# EAGLE design sc (EAGLE 6.5.0)
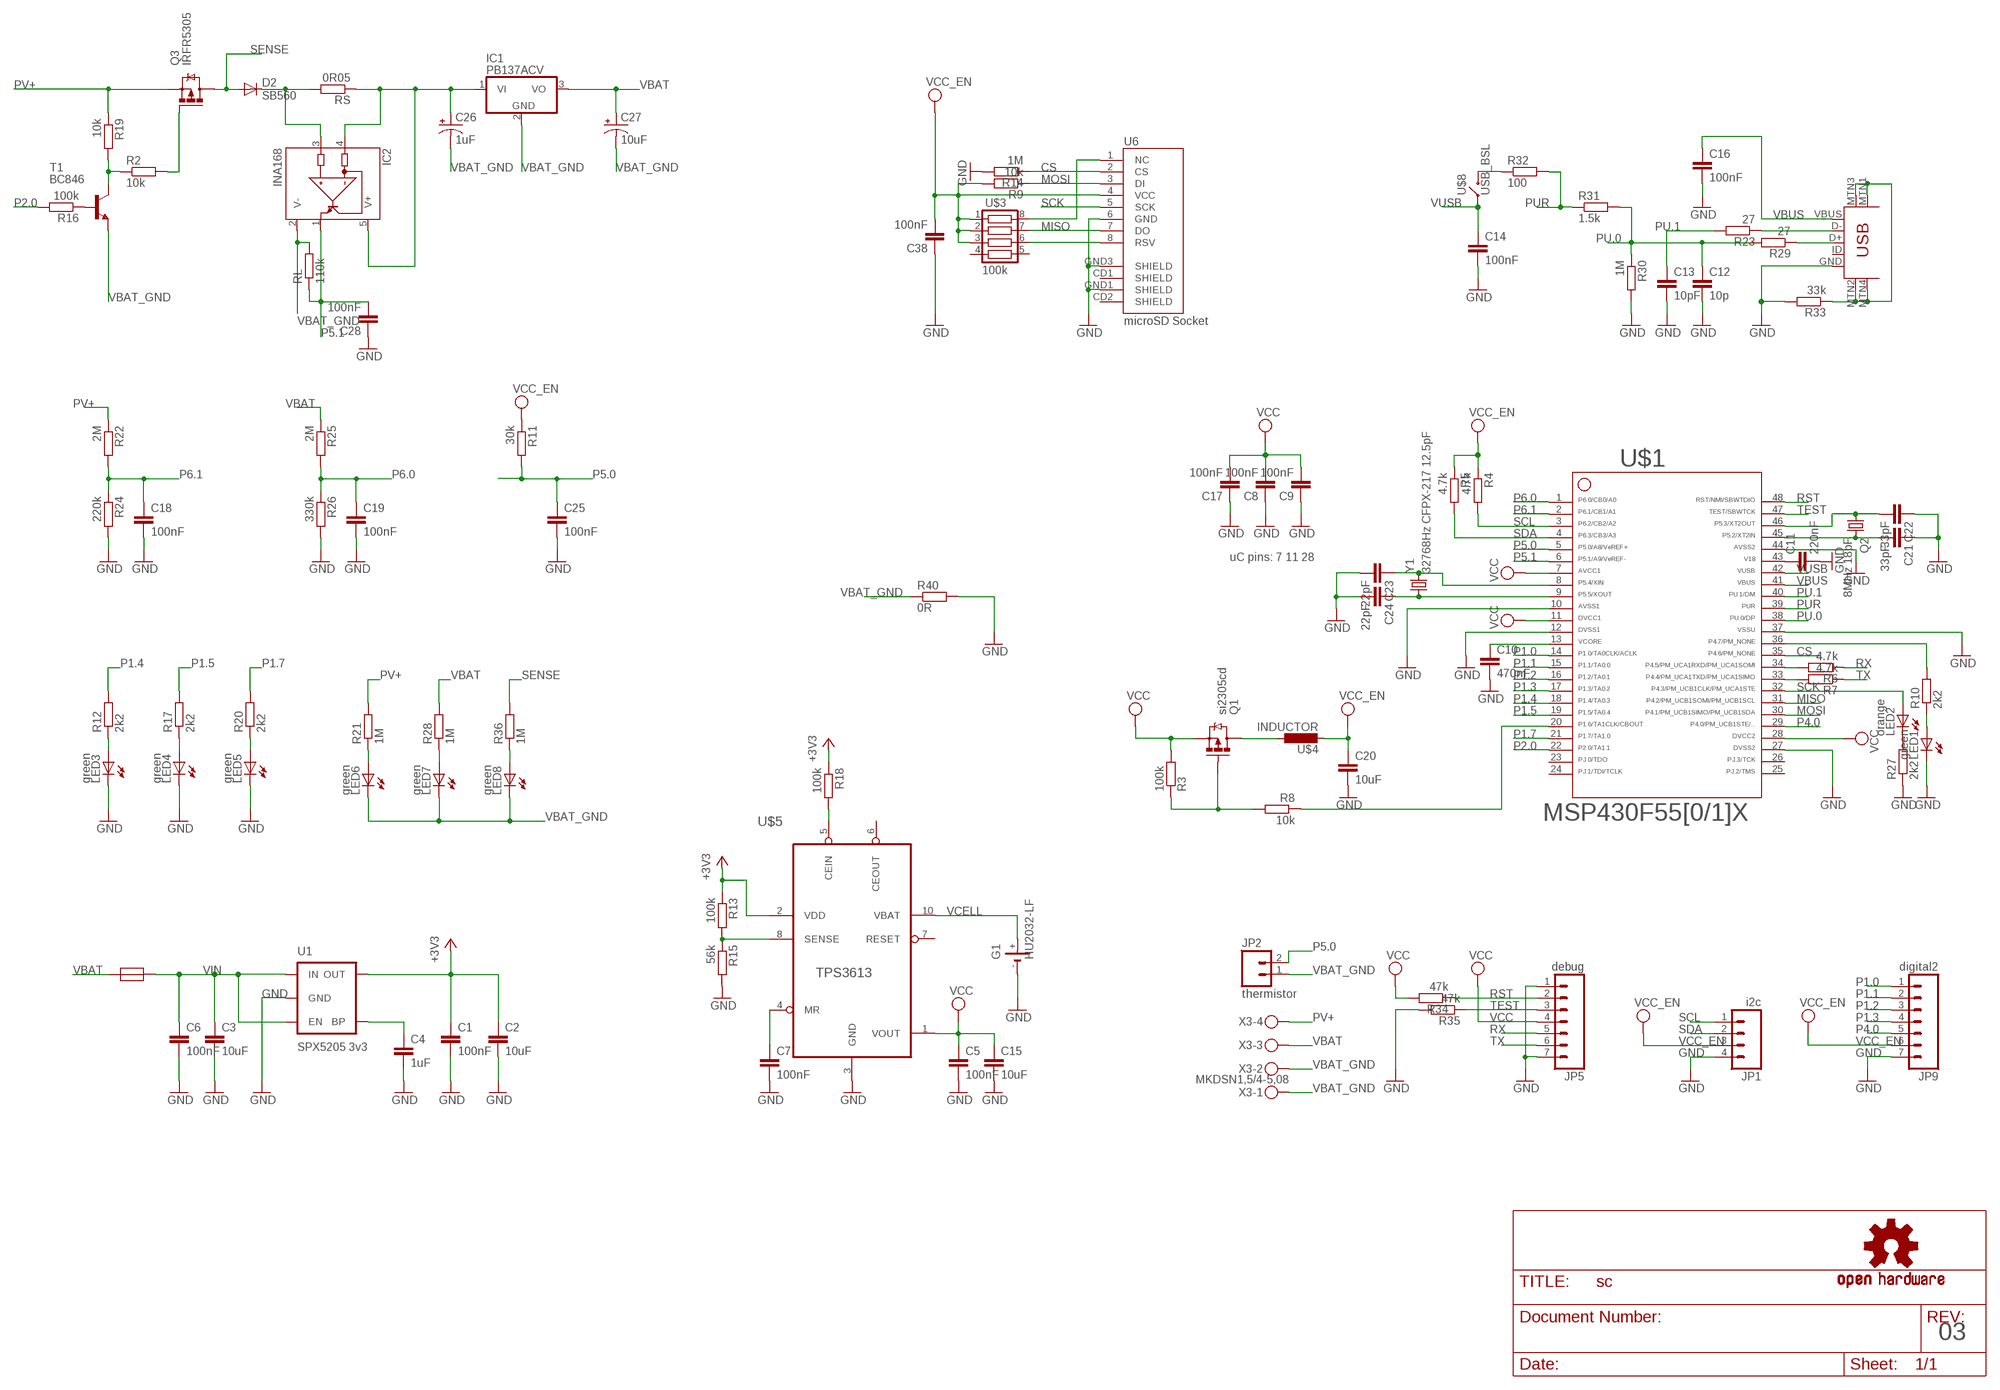
[diagram p0: schematic, sheet 1]

## Parts
C1  100nF  C-EUC0805  [C0805]
C2  10uF  C-EUC1206  [C1206]
C3  10uF  C-EUC1206  [C1206]
C4  1uF  C-EUC0805  [C0805]
C5  100nF  C-EUC0805  [C0805]
C6  100nF  C-EUC0805  [C0805]
C7  100nF  C-EUC0805  [C0805]
C8  100nF  C-EUC0805  [C0805]
C9  100nF  C-EUC0805  [C0805]
C10  470nF  C-EUC0805  [C0805]
C11  220nF  C-EUC0805  [C0805]
C12  10p  C-EUC0805  [C0805]
C13  10pF  C-EUC0805  [C0805]
C14  100nF  C-EUC0805  [C0805]
C15  10uF  C-EUC1206  [C1206]
C16  100nF  C-EUC0805  [C0805]
C17  100nF  C-EUC0805  [C0805]
C18  100nF  C-EUC0805  [C0805]
C19  100nF  C-EUC0805  [C0805]
C20  10uF  C-EUC1206  [C1206]
C21  33pF  C-EUC0805  [C0805]
C22  33pF  C-EUC0805  [C0805]
C23  22pF  C-EUC0805  [C0805]
C24  22pF  C-EUC0805  [C0805]
C25  100nF  C-EUC0805  [C0805]
C26  1uF  CAP_POLD  [PANASONIC_D]
C27  10uF  CAP_POLD  [PANASONIC_D]
C28  100nF  C-EUC0805  [C0805]
C38  100nF  C-EUC0805  [C0805]
D2  SB560  DIODE-C1702-05  [C1702-05]
G1  HU2032-LF  [HU2032-LF]
IC1  PB137ACV  7812TV  [TO220V]
IC2  INA168  [SOT23-5]
JP1  i2c  M04PTH  [1X04]
JP2  thermistor  M02PTH  [1X02]
JP5  debug  M07  [1X07]
JP9  digital2  M07  [1X07]
LED1  green  LEDCHIP-LED0805  [CHIP-LED0805]
LED2  orange  LEDCHIP-LED0805  [CHIP-LED0805]
LED3  green  LEDCHIP-LED0805  [CHIP-LED0805]
LED4  green  LEDCHIP-LED0805  [CHIP-LED0805]
LED5  green  LEDCHIP-LED0805  [CHIP-LED0805]
LED6  green  LEDCHIP-LED0805  [CHIP-LED0805]
LED7  green  LEDCHIP-LED0805  [CHIP-LED0805]
LED8  green  LEDCHIP-LED0805  [CHIP-LED0805]
Q1  si2305cd  MOSFET-PCHANNELSMD_POWER  [SOT23-3_POWER]
Q2  8MHz 18pF  CRYTAL  [CRYSTAL_5X3.2]
Q3  IRFR5305  [D-PAK_TO252AA]
R2  10k  R-EU_R0805W  [R0805W]
R3  100k  R-EU_R0805W  [R0805W]
R4  4.7k  R-EU_R0805W  [R0805W]
R5  4.7k  R-EU_R0805W  [R0805W]
R6  4.7k  R-EU_R0805W  [R0805W]
R7  4.7k  R-EU_R0805W  [R0805W]
R8  10k  R-EU_R0805W  [R0805W]
R9  10k  R-EU_R0805W  [R0805W]
R10  2k2  R-EU_R0805W  [R0805W]
R11  30k  R-EU_R0805W  [R0805W]
R12  2k2  R-EU_R0805W  [R0805W]
R13  100k  R-EU_R0805W  [R0805W]
R14  1M  R-EU_R0805W  [R0805W]
R15  56k  R-EU_R0805W  [R0805W]
R16  100k  R-EU_R0805W  [R0805W]
R17  2k2  R-EU_R0805W  [R0805W]
R18  100k  R-EU_R0805W  [R0805W]
R19  10k  R-EU_R0805W  [R0805W]
R20  2k2  R-EU_R0805W  [R0805W]
R21  1M  R-EU_R0805W  [R0805W]
R22  2M  R-EU_R0805W  [R0805W]
R23  27  R-EU_R0805W  [R0805W]
R24  220k  R-EU_R0805W  [R0805W]
R25  2M  R-EU_R0805W  [R0805W]
R26  330k  R-EU_R0805W  [R0805W]
R27  2k2  R-EU_R0805W  [R0805W]
R28  1M  R-EU_R0805W  [R0805W]
R29  27  R-EU_R0805W  [R0805W]
R30  1M  R-EU_R0805W  [R0805W]
R31  1.5k  R-EU_R0805W  [R0805W]
R32  100  R-EU_R0805W  [R0805W]
R33  33k  R-EU_R0805W  [R0805W]
R34  47k  R-EU_R0805W  [R0805W]
R35  47k  R-EU_R0805W  [R0805W]
R36  1M  R-EU_R0805W  [R0805W]
R40  0R  R-EU_R0805W  [R0805W]
RL  110k  R-EU_R0805W  [R0805W]
RS  0R05  R-EU_TO220_V  [TO220ACS]
T1  BC846  [SOT23]
U1  SPX5205 3v3  V_REG_LDOSMD  [SOT23-5]
U6  microSD Socket  USD-SOCKETNEW  [MICRO-SD-SOCKET-PP]
U$1  F55[0/1]X---PT48  [PT48]
U$2  RESETTABLE  [1210]
U$3  100k  RES_ARR  [YC164]
U$4  INDUCTOR  [L0805W]
U$5  TPS3613  [MSOP_10P]
U$6  USB-MINIB-5PIN  [USB-MINIB]
U$7  OSHW-LOGOM  [OSHW-LOGO-M]
U$8  USB_BSL  TACT_SW  [6X3.5_TACTILE_SW]
X3  MKDSN1,5/4-5,08  [MKDSN1,5/4-5,08]
Y1  32768Hz CFPX-217 12.5pF  CRYSTAL3.2X1.5  [CRYSTAL-SMD-3.2X1.5]

## Nets
+3V3: C1.1 C2.1 R13.1 R18.1 U1.5(OUT) U$5.2(VDD)
CS: R14.1 U6.2(CS) U$1.35
EN: R8.1 U$1.20
GND: C1.2 C2.2 C3.2 C4.2 C5.2 C6.2 C7.2 C8.1 C9.1 C10.2 C11.2 C12.2 C13.2 C14.2 C15.2 C16.2 C17.1 C18.2 C19.2 C20.2 C21.1 C22.1 C23.2 C24.2 C25.2 C28.1 C38.1 G1.- JP1.4 JP5.1 JP5.7 JP9.7 LED1.C LED3.C LED4.C LED5.C R14.2 R15.2 R24.2 R26.2 R27.1 R30.2 R33.2 R35.2 R40.2 U1.2(GND) U6.6(GND) U6.GND1(SHIELD) U6.GND3(SHIELD) U$1.10 U$1.12 U$1.27 U$1.37 U$1.44 U$5.3(GND) U$6.GND
LED: R10.2 U$1.36
MISO: U6.7(DO) U$1.31 U$3.7
MOSI: R9.1 U6.3(DI) U$1.30
N$1: LED1.A R10.1
N$2: C4.1 U1.4(BP)
N$3: R16.1 T1.1(B)
N$4: U6.1(NC) U$3.8
N$5: R2.1 R19.2 T1.3(C)
N$6: C10.1 U$1.13
N$7: C11.1 U$1.43
N$9: LED3.A R12.1
N$10: C26.+ IC1.1(VI) IC2.4(IN-) IC2.5(V+) RS.A
N$11: R6.2 U$1.34
N$12: LED6.A R21.1
N$13: R7.2 U$1.33
N$14: Q1.1(G) R3.1 R8.2
N$15: LED4.A R17.1
N$16: LED5.A R20.1
N$17: C22.2 Q2.P$1 U$1.46
N$18: LED7.A R28.1
N$19: R13.2 R15.1 U$5.8(SENSE)
N$20: C7.1 U$5.4(MR)
N$21: R18.2 U$5.5(CEIN)
N$22: R29.1 U$6.D+
N$23: C21.2 Q2.P$2 U$1.45
N$24: LED8.A R36.1
N$25: C24.1 U$1.9 Y1.P$1
N$26: C23.1 U$1.8 Y1.P$2
N$27: U6.8(RSV) U$3.6
N$28: Q3.1(G) R2.2
N$29: R23.1 U$6.D-
N$30: D2.C IC2.3(IN+) RS.C
N$34: R32.1 U$8.2
N$36: R33.1 U$6.MTN1(MTN2) U$6.MTN2(MTN3) U$6.MTN3(MTN1) U$6.MTN4
N$37: Q1.3(D) U$4.1
N$39: LED2.C R27.2
P1.0: JP9.1 U$1.14
P1.1: JP9.2 U$1.15
P1.2: JP9.3 U$1.16
P1.3: JP9.4 U$1.17
P1.4: R12.2 U$1.18
P1.5: R17.2 U$1.19
P1.7: R20.2 U$1.21
P2.0: R16.2 U$1.22
P4.0: JP9.5 U$1.29
P5.0: C25.1 JP2.2 R11.2 U$1.5
P5.1: C28.2 IC2.1(OUT) RL.1 U$1.6
P6.0: C19.1 R25.2 R26.1 U$1.1
P6.1: C18.1 R22.2 R24.1 U$1.2
PU.0: C12.1 R29.2 R30.1 R31.2 U$1.38
PU.1: C13.1 R23.2 U$1.40
PUR: R31.1 R32.2 U$1.39
PV+: Q3.3(S) R19.1 R21.2 R22.1 X3.4
RST: JP5.2 R34.1 U$1.48
RX: JP5.5 R6.1
SCK: LED2.A U6.5(SCK) U$1.32
SCL: JP1.1 R4.2 U$1.3
SDA: JP1.2 R5.2 U$1.4
SENSE: D2.A Q3.4(D) R36.2
TEST: JP5.3 R35.1 U$1.47
TX: JP5.6 R7.1
VBAT: C27.+ IC1.3(VO) R25.1 R28.2 U$2.P$1 X3.3
VBAT_GND: C26.- C27.- IC1.2(GND) IC2.2(V-) JP2.1 LED6.C LED7.C LED8.C R40.1 RL.2 T1.2(E) X3.1 X3.2
VBUS: C16.1 U$1.41 U$6.VBUS
VCC: C5.1 C8.2 C9.2 C15.1 C17.2 JP5.4 Q1.2(S) R3.2 R34.2 U$1.7 U$1.11 U$1.28 U$5.1(VOUT)
VCC_EN: C20.1 C38.2 JP1.3 JP9.6 R4.1 R5.1 R9.2 R11.1 U6.4(VCC) U$3.1 U$3.2 U$3.3 U$4.2
VCELL: G1.+ U$5.10(VBAT)
VIN: C3.1 C6.1 U1.1(IN) U1.3(EN) U$2.P$2
VUSB: C14.1 U$1.42 U$8.1
Unconnected: G1.+@1(+) U6.CD1(SHIELD) U6.CD2(SHIELD) U$1.23 U$1.24 U$1.25 U$1.26 U$3.4 U$3.5 U$5.6(CEOUT) U$5.7(RESET) U$6.ID

## Notes on the sheet
- uC pins: 7 11 28
- 03

## Library data of the parts
C1-C25 C28 C38 = rcl:C-EU: CAPACITOR, European symbol
C26 C27 = SparkFun-Capacitors:CAP_POL: Capacitor Polarized These are standard SMD and PTH capacitors. Normally 10uF, 47uF, and 100uF in electrolytic and tantalum varieties. Always verify the external diameter of the through hole cap, it varies with capacity, voltage, and manufacturer. The EIA devices should be standard.
D2 = diode:DIODE-: DIODE
G1 = Simplex-Battery:HU2032-LF: Renata HU2032 Li battery holder
IC1 = linear:78*: Positive VOLTAGE REGULATOR Source: http://cache.national.com/ds/LM/LM78L05.pdf http://www.fairchildsemi.com/ds/LM/LM7805.pdf
IC2 = burr-brown:INA168: High-Side Measurement Current Shunt Monitor; MF: TEXAS INSTRUMENTS; MPN: INA168NA/250; OC_FARNELL: 4375737; OC_NEWARK: 35C1744
JP1 = SparkFun-Connectors:M04: Header 4 Standard 4-pin 0.1" header. Use with straight break away headers (SKU : PRT-00116), right angle break away headers (PRT-00553), swiss pins (PRT-00743), machine pins (PRT-00117), and female headers (PRT-00115). Molex polarized connector foot print use with SKU : PRT-08231 with associated crimp pins and housings. 1MM SMD Version SKU: PRT-10208
JP2 = SparkFun-Connectors:M02: Header 2 Standard 2-pin 0.1" header. Use with straight break away headers (SKU : PRT-00116), right angle break away headers (PRT-00553), swiss pins (PRT-00743), machine pins (PRT-00117), and female headers (PRT-00115). Molex polarized connector foot print use with SKU : PRT-08233 with associated crimp pins and housings.
JP5 JP9 = SparkFun-Connectors:M07: Header 7 Standard 7-pin 0.1" header. Use with straight break away headers (SKU : PRT-00116), right angle break away headers (PRT-00553), swiss pins (PRT-00743), machine pins (PRT-00117), and female headers (PRT-00115). NOTES ON THE VARIANTS LOCK and LOCK_LONGPADS... This footprint was designed to help hold the alignment of a through-hole component (i.e. 7-pin header) while soldering it into place. You may notice that each hole has been shifted either up or down by 0.005 of an inch from it's more standard position (which is usually a perfectly straight line). This slight alteration caused the pins (the squares in the middle) to touch the edges of the holes. Because they are alternating, it causes a "brace" to hold the header in place. 0.005 has proven to be the perfect amount of "off-center" position when using our standard breakaway headers. Although looks a little odd when you look at the bare footprint, once you have a header in there, the alteration is very hard to notice. Also, if you push a header all the way into place, it is covered up entirely on the bottom side. This idea of altering the position of holes to aid alignment will be further integrated into the Sparkfun Library for other footprints. It can help hold any component with 3 or more connection pins.
LED1-LED8 = led:LED: LED OSRAM: - CHIPLED LG R971, LG N971, LY N971, LG Q971, LY Q971, LO R971, LY R971 LH N974, LH R974 LS Q976, LO Q976, LY Q976 LO Q996 - Hyper CHIPLED LW Q18S LB Q993, LB Q99A, LB R99A - SideLED LS A670, LO A670, LY A670, LG A670, LP A670 LB A673, LV A673, LT A673, LW A673 LH A674 LY A675 LS A676, LA A676, LO A676, LY A676, LW A676 LS A679, LY A679, LG A679 - Hyper Micro SIDELED® LS Y876, LA Y876, LO Y876, LY Y876 LT Y87S - SmartLED LW L88C, LW L88S LB L89C, LB L89S, LG L890 LS L89K, LO L89K, LY L89K LS L896, LA L896, LO L896, LY L896 - TOPLED LS T670, LO T670, LY T670, LG T670, LP T670 LSG T670, LSP T670, LSY T670, LOP T670, LYG T670 LG T671, LOG T671, LSG T671 LB T673, LV T673, LT T673, LW T673 LH T674 LS T676, LA T676, LO T676, LY T676, LB T676, LH T676, LSB T676, LW T676 LB T67C, LV T67C, LT T67C, LS T67K, LO T67K, LY T67K, LW E67C LS E67B, LA E67B, LO E67B, LY E67B, LB E67C, LV E67C, LT E67C LW T67C LS T679, LY T679, LG T679 LS T770, LO T770, LY T770, LG T770, LP T770 LB T773, LV T773, LT T773, LW T773 LH T774 LS E675, LA E675, LY E675, LS T675 LS T776, LA T776, LO T776, LY T776, LB T776 LHGB T686 LT T68C, LB T68C - Hyper Mini TOPLED® LB M676 - Mini TOPLED Santana® LG M470 LS M47K, LO M47K, LY M47K Source: http://www.osram.convergy.de LUXEON: - LUMILED® LXK2-PW12-R00, LXK2-PW12-S00, LXK2-PW14-U00, LXK2-PW14-V00 LXK2-PM12-R00, LXK2-PM12-S00, LXK2-PM14-U00 LXK2-PE12-Q00, LXK2-PE12-R00, LXK2-PE12-S00, LXK2-PE14-T00, LXK2-PE14-U00 LXK2-PB12-K00, LXK2-PB12-L00, LXK2-PB12-M00, LXK2-PB14-N00, LXK2-PB14-P00, LXK2-PB14-Q00 LXK2-PR12-L00, LXK2-PR12-M00, LXK2-PR14-Q00, LXK2-PR14-R00 LXK2-PD12-Q00, LXK2-PD12-R00, LXK2-PD12-S00 LXK2-PH12-R00, LXK2-PH12-S00 LXK2-PL12-P00, LXK2-PL12-Q00, LXK2-PL12-R00 Source: www.luxeon.com KINGBRIGHT: KA-3528ASYC Source: www.kingbright.com
Q1 = Simplex-DiscreteSemi:MOSFET-PCHANNEL: Generic PMOSFET
Q2 = Omat_komponentit:CRYTAL: CRYSTAL
Q3 = transistor-power:IRF?5305: HEXFET Power MOSFET Source: http://www.irf.com/product-info/datasheets/data/irfr5305pbf.pdf
R2-R36 R40 RL = rcl:R-EU_: RESISTOR, European symbol
RS = Simplex-rlc:R-EU_: RESISTOR, European symbol
T1 = transistor:BC846: NPN TRANSISTOR
U1 = SparkFun:V_REG_LDO: Voltage Regulator LDO Standard 150mA LDO voltage regulator in SOT-23 layout. Micrel part MIC5205. BP (by-pass) pin is used to lower output noise with 470pF cap.
U6 = SparkFun:USD-SOCKET: microSD Socket Push-push type uSD socket. Schematic element and footprint production proven. Spark Fun Electronics SKU : PRT-00127. tDoc lines correctly indicate media card edge positions when inserting (unlocked, locked, depressed).
U$1 = TI_MSP430_v16:F55[0/1]X---PT48: ***F55[0/1/2]X*** PT48 Rev. 1.0 06/2010 "http://www.ti.com/lit/gpn/msp430f5509" Only for FF5504, F5508,F5509,F5510
U$2 = Simplex-Fuses:RESETTABLE
U$3 = Simplex-rlc:RES_ARR: resistor chip array yageo YC164 series (8pin/4R)
U$4 = Simplex-rlc:INDUCTOR: smd inductors
U$5 = Simplex-ICs:TPS3613: Texas Instruments TPS3613 Adjustable battery-backup supervisor for RAM retension
U$6 = SparkFun-Connectors:USB-MINIB: Mini-USB "B" connector with 5th pin broken out. Created new symbol breaking out 5th "ID" pin in mini/micro USB connector spec. See: http://en.wikipedia.org/wiki/Mini_usb#Cables. Uses same footprint as 4-pin symbol. Also added pins to connect to mounting / shield pads if required (probably not generally needed as signals aren't shielded once they leave the connector).
U$7 = SparkFun:OSHW-LOGO: Open Source Hardware Logo This logo indicates the piece of hardware it is found on incorporates a OSHW license and/or adheres to the definition of open source hardware found here: http://freedomdefined.org/OSHW
U$8 = Simplex-Switches:TACT_SW: SPST tactile switches
X3 = con-phoenix-508:MKDSN1,5/4-5,08: MKDSN 1,5/ 4-5,08 Printklemme Nennstrom: 13,5 A Nennspannung: 250 V Rastermaß: 5,08 mm Polzahl: 4 Anschlussart: Schraubanschluss Montage: Löten Anschlussrichtung Leiter/Platine: 0 ° Artikelnummer: 1729144 Source: http://eshop.phoenixcontact.com .. 1729144.pdf; MPN: SMKDSN1,5/4-5,08; OC_FARNELL: 1792905; OC_NEWARK: 70R0300
Y1 = Simplex-FreqCtrl:CRYSTAL: smd crystals

## Net classes
1 vcc: width 0.203 mm

## Board
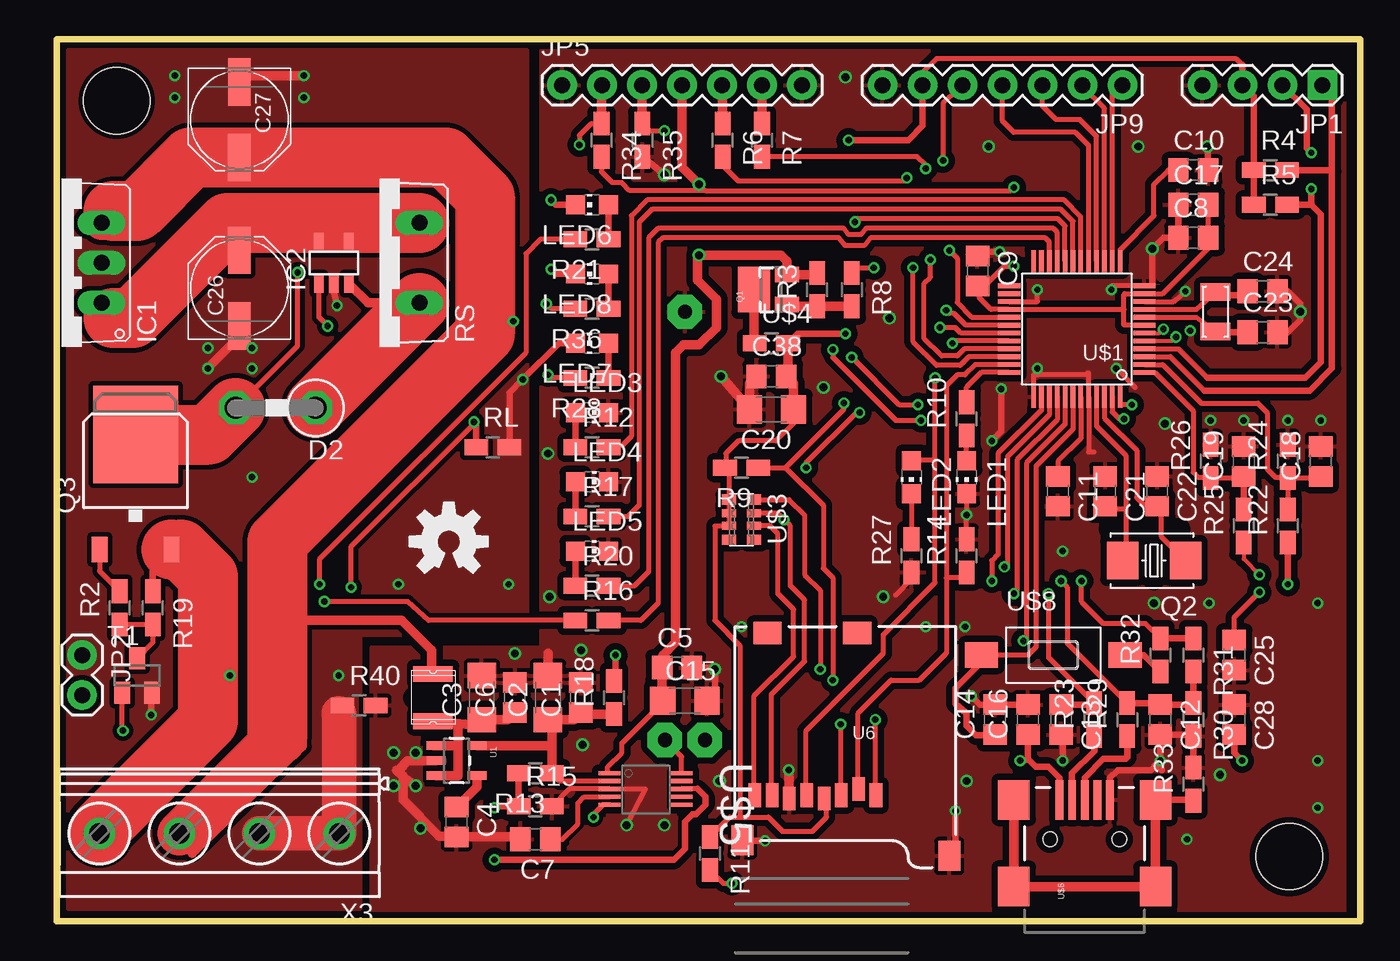
[diagram p1: board, top side]
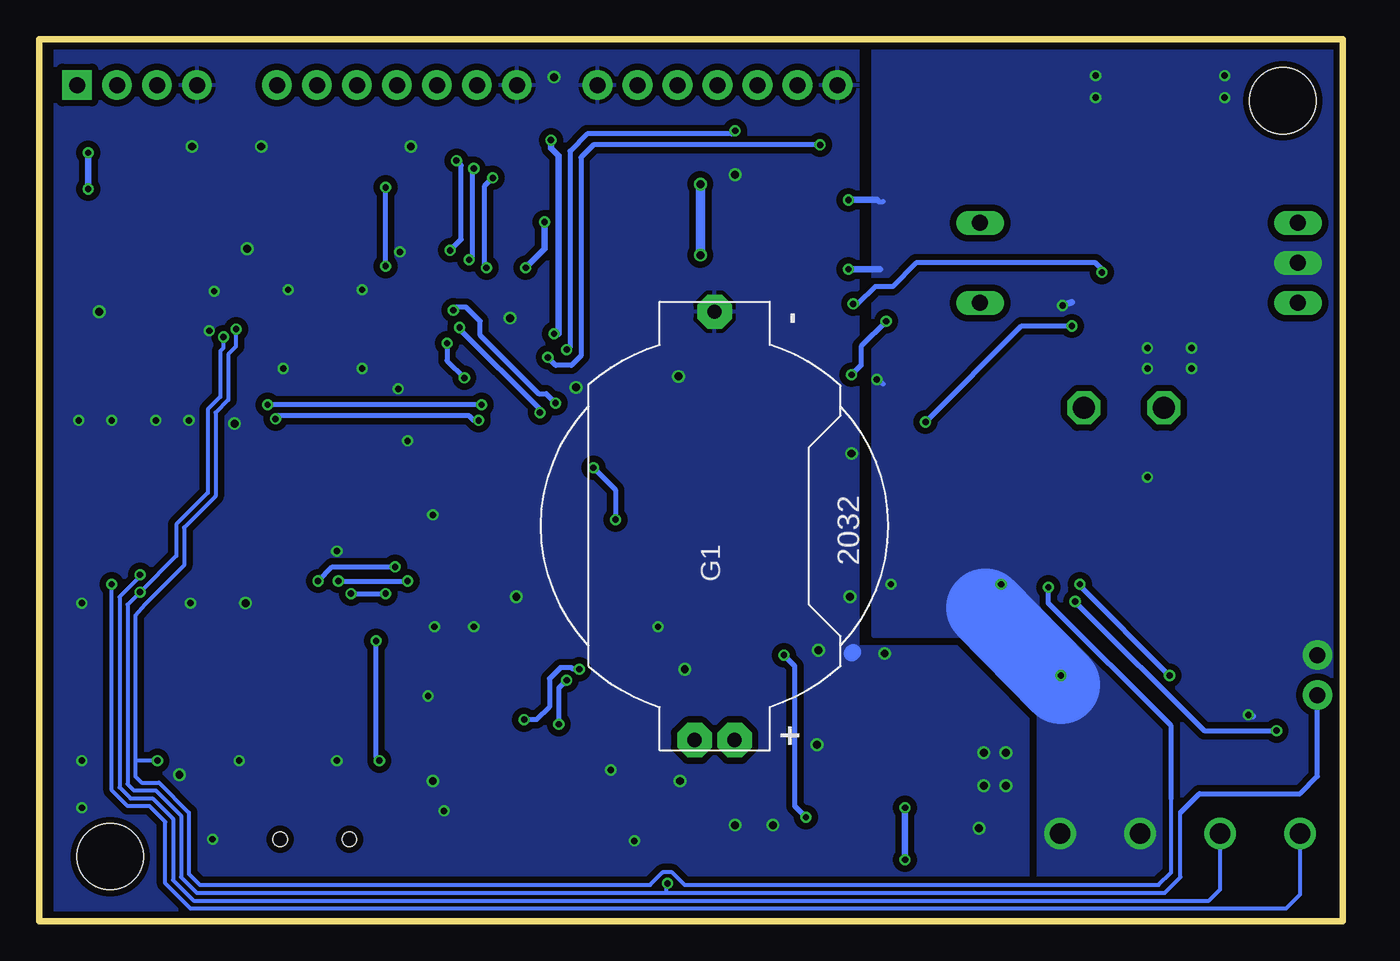
[diagram p2: board, bottom side, seen from below]

Size 82.8 x 56 mm. Coordinates in mm from the lower left corner, seen from the top.
Outline: 0,0 82.8,0 82.8,56 0,56 0,0
Copper layers (1*16): Top 0.035mm / dielectric 1.5mm / Bottom 0.035mm
Design rules "seeedstudio_rules_v1.1": minimum track width 6mil, minimum drill 12mil, track to track 6mil, track to pad 6mil, pad to pad 6mil, via to via 6mil, smd to smd 0mil, copper to edge 10mil, drill to drill 10mil, minimum pad ring 10mil, minimum via ring 6mil, stop-mask expansion 2mil, vias tented up to drill 100mil, thermal gap 10mil
Holes 4.2 mm at 3.8,52.1 78.3,4.1
tRestrict: 4 lines

### Footprints (pad centres in the part's own frame; a part is rotated, then mirrored left to right if it is on the bottom)
C0805 = smd 1.3 x 1.5: 1 -0.95,0; 2 0.95,0
C1206 = smd 1.6 x 1.8: 1 -1.4,0; 2 1.4,0
PANASONIC_D = smd 3 x 1.4: + 2.4,0; - -2.4,0
C1702-05 = drill 1.397 octagon: A 2.54,0; C -2.54,0
HU2032-LF = drill 0.9 pad 2.184 octagon: + -13.6,-1.27; +@1 -13.6,1.27; - 13.6,0
TO220V = drill 1.016 long: 1 -2.54,-2.54; 2 0,-2.54; 3 2.54,-2.54
SOT23-5 = smd 0.6 x 1.2: 1 -0.95,-1.306; 2 0,-1.306; 3 0.95,-1.306; 4 0.95,1.306; 5 -0.95,1.306
1X04 = drill 1.016 pad 1.88 square: 1 0,0 | drill 1.016 pad 1.88: 2 2.54,0; 3 5.08,0; 4 7.62,0
1X02 = drill 1.016 pad 1.88: 1 0,0; 2 2.54,0
1X07 = drill 1.016 pad 1.88: 1 0,0; 2 2.54,0; 3 5.08,0; 4 7.62,0; 5 10.16,0; 6 12.7,0; 7 15.24,0
CHIP-LED0805 = smd 1.2 x 1.2: A 0,-1.05; C 0,1.05
SOT23-3_POWER = smd 1 x 1.5: 1 -0.939,-1.384; 2 0.961,-1.384 | smd 2.9 x 2.05: 3 0.011,0.716
CRYSTAL_5X3.2 = smd 2 x 2.4: P$1 -2,0; P$2 2,0
D-PAK_TO252AA = smd 1 x 1.6: 1 -2.28,-4.8; 3 2.28,-4.8 | smd 5.4 x 6.2: 4 0,2.5
R0805W = smd 1.5 x 1: 1 -1.052,0; 2 1.052,0
TO220ACS = drill 1.016 long: A 2.54,-2.54; C -2.54,-2.54
SOT23 = smd 1 x 1.4: 1 -0.95,-1.1; 2 0.95,-1.1; 3 0,1.1
SOT23-5' = smd 0.55 x 1.2: 1 -0.95,-1.3; 2 0,-1.3; 3 0.95,-1.3; 4 0.95,1.3; 5 -0.95,1.3
MICRO-SD-SOCKET-PP = smd 0.8 x 1.5: 1 -8.94,10.7; 2 -7.84,10.3; 3 -6.74,10.7; 4 -5.64,10.9; 5 -4.54,10.7; 6 -3.44,10.9; 7 -2.34,10.7; 8 -1.24,10.7 | smd 1.8 x 1.4: CD1 -2.05,0.4; CD2 -7.75,0.4 | smd 1.4 x 1.9: GND1 -13.6,14.55; GND3 -0.45,13.55
PT48 = smd 1.4 x 0.3: 1 -4.3,2.75; 2 -4.3,2.25; 3 -4.3,1.75; 4 -4.3,1.25; 5 -4.3,0.75; 6 -4.3,0.25; 7 -4.3,-0.25; 8 -4.3,-0.75; 9 -4.3,-1.25; 10 -4.3,-1.75; 11 -4.3,-2.25; 12 -4.3,-2.75; 25 4.3,-2.75; 26 4.3,-2.25; 27 4.3,-1.75; 28 4.3,-1.25; 29 4.3,-0.75; 30 4.3,-0.25; 31 4.3,0.25; 32 4.3,0.75; 33 4.3,1.25; 34 4.3,1.75; 35 4.3,2.25; 36 4.3,2.75 | smd 0.3 x 1.4: 13 -2.75,-4.3; 14 -2.25,-4.3; 15 -1.75,-4.3; 16 -1.25,-4.3; 17 -0.75,-4.3; 18 -0.25,-4.3; 19 0.25,-4.3; 20 0.75,-4.3; 21 1.25,-4.3; 22 1.75,-4.3; 23 2.25,-4.3; 24 2.75,-4.3; 37 2.75,4.3; 38 2.25,4.3; 39 1.75,4.3; 40 1.25,4.3; 41 0.75,4.3; 42 0.25,4.3; 43 -0.25,4.3; 44 -0.75,4.3; 45 -1.25,4.3; 46 -1.75,4.3; 47 -2.25,4.3; 48 -2.75,4.3
1210 = smd 1 x 2.5: P$1 -1.5,0; P$2 1.5,0
YC164 = smd 0.65 x 0.9: 1 -1.275,-0.8; 4 1.275,-0.8; 5 1.275,0.8; 8 -1.275,0.8 | smd 0.5 x 0.9: 2 -0.4,-0.8; 3 0.4,-0.8; 6 0.4,0.8; 7 -0.4,0.8
L0805W = smd 1.5 x 1: 1 -1.052,0; 2 1.052,0
MSOP_10P = smd 0.27 x 1.4: 1 0,0; 2 0.5,0; 3 1,0; 4 1.5,0; 5 2,0; 6 2,4.6; 7 1.5,4.6; 8 1,4.6; 9 0.5,4.6; 10 0,4.6
USB-MINIB = smd 2.5 x 0.5: D+ 2.5,0; D- 2.5,0.8; GND 2.5,-1.6; ID 2.5,-0.8; VBUS 2.5,1.6 | smd 2.5 x 2: MTN1 -3,4.5; MTN2 2.5,4.5; MTN3 -3,-4.5; MTN4 2.5,-4.5 | hole 0.9: 0,2.2; 0,-2.2
6X3.5_TACTILE_SW = smd 2.12 x 1.6: 1 -4.56,0; 2 4.56,0
MKDSN1,5/4-5,08 = drill 1.3 pad 2: 1 -7.641,0.025; 2 -2.561,0.025; 3 2.519,0.025; 4 7.599,0.025
CRYSTAL-SMD-3.2X1.5 = smd 1.1 x 1.9: P$1 -1.25,0; P$2 1.25,0

### Placement (x,y rotation side)
C1  33.3,14.2 90 top
C2  31.2,14.2 90 top
C3  27,14.2 90 top
C4  25.4,6.3 270 top
C5  39.4,16.1 0 top
C6  29.1,14.2 90 top
C7  30.4,5.2 180 top
C8  72.2,43.4 0 top
C9  58.5,41.3 270 top
C10  72.2,47.7 0 top
C11  63.6,27.3 270 top
C12  70.1,12.8 270 top
C13  63.8,12.8 270 top
C14  59.6,12.8 90 top
C15  39.9,14 0 top
C16  61.7,12.8 90 top
C17  72.2,45.5 0 top
C18  80.3,29.2 90 top
C19  75.4,29.2 90 top
C20  45.4,32.5 180 top
C21  66.6,27.3 270 top
C22  69.9,27.3 270 top
C23  76.6,37.4 0 top
C24  76.6,40 0 top
C25  74.8,16.9 270 top
C26  11.6,40.2 90 top
C27  11.6,50.9 270 top
C28  74.8,12.8 270 top
C38  45.4,34.6 0 top
D2  13.9,32.6 180 top
G1  39.9,25.1 90 bottom
IC1  0.3,41.8 90 top
IC2  17.6,41.8 0 top
JP1  80.4,53.1 180 top
JP2  1.6,16.9 270 top
JP5  32.1,53.1 0 top
JP9  67.7,53.1 180 top
LED1  57.8,28.2 180 top
LED2  54.3,28.2 180 top
LED3  34,32.3 270 top
LED4  34,27.9 270 top
LED5  34,23.5 270 top
LED6  34,45.5 90 top
LED7  34,36.7 90 top
LED8  34,41.1 90 top
Q1  45,40.1 90 top
Q2  69.7,22.9 180 top
Q3  5,28.4 0 top
R2  4,19.9 90 top
R3  48.3,40.1 90 top
R4  77.1,47.7 0 top
R5  77.1,45.5 0 top
R6  42.3,49.6 270 top
R7  44.8,49.6 270 top
R8  50.5,40.1 270 top
R9  43.5,28.8 180 top
R10  57.8,31.9 90 top
R11  41.5,4.3 270 top
R12  34,30.1 0 top
R13  30.4,9.4 180 top
R14  57.8,23.2 90 top
R15  30.4,7.3 0 top
R16  34,19.1 0 top
R17  34,25.7 0 top
R18  35.4,14.2 90 top
R19  6.1,19.9 270 top
R20  34,21.3 0 top
R21  34,43.3 180 top
R22  78.2,25.1 90 top
R23  65.9,12.8 90 top
R24  78.2,29.2 90 top
R25  75.4,25.1 90 top
R26  73.3,29.2 90 top
R27  54.3,23.2 90 top
R28  34,34.5 180 top
R29  68,12.8 90 top
R30  72.2,12.8 270 top
R31  72.2,16.9 270 top
R32  70.1,16.9 90 top
R33  72.2,8.7 90 top
R34  34.6,49.6 270 top
R35  37.2,49.6 270 top
R36  34,38.9 180 top
R40  19.2,13.7 0 top
RL  27.7,30.1 0 top
RS  20.5,41.8 90 top
T1  5.1,15.6 0 top
U1  SPX5205 3v3  [SOT23-5']  25.4,10.2 270 top
U6  43.1,18.7 180 top
U$1  64.8,37.6 180 top
U$2  23.9,14.2 270 top
U$3  43.5,25.5 270 top
U$4  45.4,36.7 0 top
U$5  35.1,9.4 270 top
U$6  65.3,5.2 90 top
U$7  24.9,24.1 0 top
U$8  63.3,16.9 0 top
X3  10.3,5.6 180 top
Y1  73.6,38.7 270 top

### Tracks (layer width: path | path; a pad name or v marks a point on that pad's centre or on a via)
+3V3
  Top 0.305: U$5.2 31.95,8.9 R13.1
  Top 0.406: 31.25,9.6 R13.1
  Top 0.61: 31.25,9.6 arc90 R13.1 31.45,11.15 | U1.5 31.45,11.15 | 31.45,11.15 31.45,12.55 C2.1 32.85,12.8 C1.1 33.3,13.15 R18.1
CS
  Top 0.305: U6.2 50.9,8.44 50.9,13.2 53,15.3 54.8,15.3 56.5,17 56.5,21.8 | U$1.35 58.35,35.35 57.7,34.7 57.2,34.7 56.5,34 56.5,21.8 | R14.1 57.45,21.8 56.5,21.8
EN  (via drill 0.4)
  Top 0.305: U$1.20 64.05,44.15 63.6,44.6 50.7,44.6 v50.7,44.4 | R8.1 50.85,41.5 v51.9,41.5
  Bottom 0.406: v50.7,44.4 50.7,42.7 v51.9,41.5
GND  (via drill 0.4, 0.5)
  Top 0.305: v36.2,6.1 37.4,8.4 U$5.3 32.55,8.4 R15.2 | U$1.10 70.95,39.35 v71.7,40 | 65.55,34.7 62.3,34.7 | U$1.37 62.05,34.7 62.3,34.7 | U$1.27 62.3,39.35 v62.3,40.1 | 62.3,34.7 v62.3,35.1 | U$1.12 67,40.35 v67,40.1 | R14.2 v57.8,25.8 LED1.C | 53.3,20.7 54.3,21.7 R27.1 | U$1.44 65.55,29.8 65.9,29.8 | v67.3,35.1 68.5,33.9 | 65.55,33.1 65.55,34.8 65.5,34.8
  Top 0.406: 69.85,9.95 69.5,9.6 67.4,9.6 66.9,9.1 U$6.GND | 69.85,9.95 v70.1,10.2 | v70.1,10.2 C12.2 72.1,11.85 R30.2 R33.2 | v63.9,10.2 63.9,11.75 C13.2 | C16.2 C14.2 58.65,13.75 v58.1,14.3 | v70.1,10.2 70.2,9.6 69.85,9.95 | C15.2 41.8,14.5 v41.8,16 41.7,16.1 C5.2 | 46.4,7.74 U6.6 | C24.2 78.2,40 79,39.2 v79,38.7 79,38.2 78.2,37.4 C23.2 | C17.1 C8.1 70.3,43.4 v69.6,42.7 69.6,40.4 | v73.1,49.2 C10.2 | R35.2 v38.6,47.4 | v60,33.8 60,31.1 v59.4,30.5 | C9.1 58.75,42.5 v59.9,42.5 | U6.GND1 57.1,4.55 v57.1,7 | U6.GND3 43.6,5.1 v45,5.1
  Top 0.61: U1.2 22.3,10.2 21.7,9.6 21.6,9.6 22,9.2 | v22.8,8.6 22.2,9 22,9.2 | C7.2 29.3,5.35 C4.2 25.35,5.4 24.3,5.4 22,7.7 22,9.2 | C20.2 v42.2,34.6 | C20.2 44,32.75 | C38.1 44,34.15 C20.2 | v46.5,9.6 46.5,7.84 U6.6 | C2.2 31.2,17
  Bottom 1.016: 31.1,17.1 31.2,17
  other vias: 33.3,17.2 38.6,6.1 22.8,10.7 31.2,29.7 63.9,23.5 69.7,20.2 29.1,17 52.9,38.3 59.2,49.2 50.1,53.6 70.4,31.6 42.1,8.9 68.7,49.2 52.5,20.6 23.1,5.9 21.4,10.7 21.4,8.6 55.2,18.7 43.5,18.7 80.1,7.2 73.2,20.2 80.1,20.2 80.1,10.2 80.3,31.8 57.8,8.9 73.9,9.3 73.3,31.8 75.4,31.8 78.2,31.8 72,37.5 31.3,20.6 71.8,5.2 57.7,18.7 48.7,33.9 33.4,11.2
  pour Top (isolate 0.254): 36,9.8 38.8,9.8 38.8,6.6 40.4,6.6 40.4,4.6 32.7,4.6 32.7,6.5 36,6.5
  pour Top (isolate 0.254): 20.8,11 23.2,11 23.2,8.3 20.8,8.3
  pour Bottom (isolate 0.406): 30.8,55.4 81.8,55.4 81.8,0.6 30.8,0.6
  pour Bottom (isolate 0.406): 20,17.4 33.2,17.4 33.2,0.5 20,0.5
  pour Top (isolate 0.406): 30.8,55.4 81.8,55.4 81.8,0.6 30.8,0.6
  pour Top (isolate 0.406): 20,17.4 33.2,17.4 33.2,0.5 20,0.5
LED
  Top 0.305: U$1.36 58.75,34.85 57.8,33.9 R10.2
MISO  (via drill 0.4)
  Top 0.305: U6.7 45.4,8.04 45.4,14.4 47.5,16.5 47.5,20.4 46.6,21.3 46.6,25.1 v46.2,25.5 45.8,25.9 U$3.7 | U$1.31 57.45,37.35 57.1,37.7 v56.1,37.7 | v47.6,28.8 47.6,29.1 50.8,32.3 v51,32.3
  Bottom 0.305: v46.2,25.5 46.2,27.4 v47.6,28.8 | v51,32.3 51,32.5 56.1,37.6 v56.1,37.7
MOSI  (via drill 0.4)
  Top 0.305: U6.3 49.8,8.04 v49.8,12.5 | U$1.30 57.75,37.85 57,38.6 56.7,38.6 v56.5,38.8 | R9.1 46.3,28.8 | 46.3,28.8 48.7,26.4 48.7,22.4 49.3,21.8 v49.3,15.3 | 46.3,28.8 50,32.5 v50,32.9
  Bottom 0.305: v49.3,15.3 49.8,14.8 v49.8,12.5 | v50,32.9 50.6,33.5 51.1,33.5 54.8,37.2 54.8,38.1 55.7,39 56.3,39 v56.5,38.8
N$1
  Top 0.305: LED1.A R10.1
N$2
  Top 0.61: C4.1 26.7,8.55 26.7,8.6 | 26.7,8.6 | 26.7,8.6 U1.4
N$3  (via drill 0.4)
  Top 0.305: R16.1 23.6,19.1 22.3,20.3 v17,20.3 | v4.2,12.1 4.15,12.15 T1.1
  Bottom 0.305: v17,20.3 8.8,12.1 v4.2,12.1
N$4  (via drill 0.4)
  Top 0.305: U6.1 52,8.04 v52,12.8 | U$3.8 46.52,26.77 47.5,25.8 47.5,22 48.5,21 v48.5,16
  Bottom 0.305: v52,12.8 51.2,12.8 50.4,13.6 50.4,15.4 49.7,16.1 49,16.1 48.9,16 v48.5,16
N$5
  Top 0.305: R2.1 R19.2 6.1,17.7 T1.3
N$6
  Top 0.305: C10.1 70.6,47.7 69.7,46.8 69.7,44.8 67.55,42.65 U$1.13
N$7
  Top 0.305: U$1.43 65.05,30.65 63.6,29.2 C11.1
N$9
  Top 0.305: 32.95,32.4 LED3.A
  Top 0.406: R12.1 32.95,32.4
N$10
  Top 0.406: C26.+ 10.84,42.54 10.84,44.34
  Top 0.813: IC2.5 15.45,44.29 15.6,44.34 | IC2.4 17.35,44.29 18.1,44.34
  Top 1.016: 11.85,44.29 11.8,44.34 | 13.75,44.29 13.7,44.34 | 16.75,44.29 16.8,44.34 | 18.65,44.29 18.6,44.34 | 3.6,38.3 2.84,39.06 IC1.1
  Top 3.81: RS.A 18.6,44.34 18.1,44.34 16.8,44.34 15.6,44.34 13.7,44.34 11.8,44.34 10.84,44.34 4.8,38.3 3.6,38.3
N$11  (via drill 0.4)
  Top 0.305: U$1.34 57.95,35.85 57.4,35.3 55.9,35.3 54.4,36.8 v54.4,41.5 | v54,47.2 54,47 43.3,47 42.3,48 R6.2
  Bottom 0.305: v54,47.2 54.5,46.7 54.5,41.6 v54.4,41.5
N$12
  Top 0.406: R21.1 35.05,43.6 LED6.A
N$13  (via drill 0.4)
  Top 0.305: U$1.33 57.65,36.35 57.2,35.9 56.2,35.9 55.1,37 55.1,40.5 55.5,40.9 v55.5,42 | v55.2,47.8 55.2,48 54.65,48.55 R7.2
  Bottom 0.305: v55.2,47.8 55.3,47.7 55.3,42.2 v55.5,42
N$14
  Top 0.61: R8.2 R3.1 46.5,39.05 Q1.1
N$15
  Top 0.305: LED4.A
  Top 0.406: R17.1 LED4.A
N$16
  Top 0.305: LED5.A
  Top 0.406: R20.1 LED5.A
N$17
  Top 0.305: U$1.46 66.55,31.95 68.6,29.9 68.6,26.9 69.15,26.35 C22.2 70.15,26.3 70.15,24.45 Q2.P$1
N$18
  Top 0.406: R28.1 35.05,36.8 LED7.A
N$19  (via drill 0.4)
  Top 0.305: 40.7,8.4 U$5.8
  Top 0.406: R13.2 R15.1 27.9,7.3 v27.8,7.2 | v27.8,3.9 39.2,3.9 39.9,4.6 39.9,6.3 40.4,6.8 40.6,6.8 41.2,7.4 41.2,7.9 40.7,8.4
  Bottom 0.406: v27.8,3.9 v27.8,7.2
N$20
  Top 0.305: C7.1 32.1,5.2 33.1,6.2 33.1,7.5 33.5,7.9 U$5.4
N$21  (via drill 0.4)
  Top 0.305: U$5.5 34.7,7.4 34.1,6.8 v34.1,6.6
  Top 0.406: R18.2 35.5,15.35 v35.5,16.9
  Bottom 0.305: v34.1,6.6 34.8,7.3 34.8,16.2 v35.5,16.9
N$22
  Top 0.406: U$6.D+ 65.3,9.1 66.5,10.3 67.9,10.3 68,10.4 R29.1
N$23
  Top 0.305: U$1.45 66.05,31.45 67.9,29.6 67.9,26.2 | 67.9,26.2 67.9,23 Q2.P$2 | C21.2 66.55,26.2 67.9,26.2
N$24
  Top 0.406: R36.1 35.05,39.2 LED8.A
N$25
  Top 0.305: U$1.9 72.4,38.85 Y1.P$1 73.5,39.75
  Top 0.406: 73.5,39.75 75.3,39.75 C24.1
N$26
  Top 0.305: U$1.8 72.4,38.35 Y1.P$2 73.5,37.65
  Top 0.406: 73.5,37.65 73.75,37.4 C23.1
N$27
  Top 0.305: U6.8 44.3,8.04 44.3,14.3 46.8,16.8 46.8,19.8 45.8,20.8 45.8,24.6 45.3,25.1 U$3.6
N$28
  Top 0.305: Q3.1 2.72,22.23 R2.2
N$29
  Top 0.406: U$6.D- 64.5,9.4 65.9,10.8 R23.1
N$30
  Top 0.61: IC2.3 19.78,39.26 RS.C
  Top 3.81: D2.C 16.44,32.66 RS.C
N$34
  Top 0.406: U$8.2 69.05,16.9 R32.1
N$36
  Top 0.406: U$6.MTN4 72.15,7.7 R33.1
  Top 0.61: U$6.MTN2 U$6.MTN1 U$6.MTN3 U$6.MTN4
N$37
  Top 0.61: Q1.3 44.28,36.76 U$4.1
N$39
  Top 0.305: LED2.C R27.2
P1.0
  Top 0.305: U$1.14 67.05,52.55 67.6,53.1 JP9.1
P1.1
  Top 0.305: U$1.15 66.55,51.61 65.16,53 JP9.2
P1.2
  Top 0.305: U$1.16 66.05,49.85 65,50.9 63.5,50.9 62.62,51.78 JP9.3
P1.3
  Top 0.305: U$1.17 65.55,49.25 64.7,50.1 60.8,50.1 60.08,50.82 JP9.4
P1.4
  Top 0.305: U$1.18 65.05,44.75 64,45.8 37.5,45.8 36.5,44.8 36.5,30.8 35.9,30.2 R12.2
P1.5
  Top 0.305: U$1.19 64.55,44.45 63.8,45.2 37.8,45.2 37,44.4 37,26.4 36.3,25.7 R17.2
P1.7
  Top 0.305: U$1.21 63.55,43.75 63.3,44 51.4,44 51.1,43.6 50.3,43.6 50,44 38.2,44 37.6,43.4 37.6,22.2 36.7,21.3 R20.2
P2.0
  Top 0.305: U$1.22 63.05,43.15 62.8,43.4 51.7,43.4 51.3,42.9 50.1,42.9 49.7,43.4 38.5,43.4 38.2,43.1 38.2,20.2 37.1,19.1 R16.2
P4.0  (via drill 0.4)
  Top 0.305: 56.3,48.2 v56.3,48.3 56.3,51.96 JP9.5 | v56.7,42.6 57.2,42.1 57.2,39.3 58.15,38.35 U$1.29
  Bottom 0.305: v56.3,48.3 56,48 56,43.3 v56.7,42.6
P5.0  (via drill 0.4)
  Top 0.254: U$1.5 70.85,36.85 v71.1,37.1
  Top 0.305: R11.2 42.35,2.4 v42.9,2.4 | C25.1 74.8,19.3 v76.4,20.9
  Bottom 0.254: 43,1.8 72.8,1.8 73.8,2.8 73.8,6.7 75.4,8.3 76.8,8.3 77.2,8.7 77.2,20.1 v76.4,20.9 74.1,23.2 74.1,25.2 72.1,27.2 72.1,32.5 71.3,33.3 71.3,36.2 71.1,36.4 v71.1,37.1 | 43,1.8 11.3,1.8 10.3,2.8 10.3,6.9 | v42.9,2.4 43,2.3 43,1.8
  Bottom 0.305: 10.3,6.9 9.1,8.1 2.7,8.1 1.6,9.2 JP2.2
P5.1  (via drill 0.4)
  Top 0.254: U$1.6 70.05,37.35 v70.3,37.6
  Top 0.305: v18.7,21.2 18.7,23.8 26.5,31.6 v26.5,31.7 | v17.2,37.8 16.65,38.35 IC2.1
  Top 0.406: 26.5,31.6 26.65,31.6 RL.1 | C28.2 74.8,10.7 v75.3,10.2
  Bottom 0.254: 76.7,10.2 76.7,19.4 76.1,20.1 73.6,22.6 73.6,25 71.6,27 71.6,32.3 70.8,33.1 70.8,36 70.3,36.5 v70.3,37.6 | 76.7,10.2 76.7,9.2 76.3,8.8 75.2,8.8 73.3,6.9 73.3,3 72.6,2.3 44,2.3 43.2,3.1 42.6,3.1 41.8,2.3 11.7,2.3 10.9,3.1 10.9,7.8 | v75.3,10.2 76.7,10.2
  Bottom 0.305: 10.9,7.8 10.9,12.4 18.7,20.2 v18.7,21.2 | v26.5,31.7 20.4,37.8 v17.2,37.8
P6.0
  Top 0.305: U$1.1 69.75,34.85 72.2,32.4 72.2,28.5 72.5,28.2 73.25,28.2 R26.1 75.3,28.15 C19.1
  Top 0.406: R25.2 C19.1
P6.1
  Top 0.305: U$1.2 70.25,35.35 72.7,32.9 76.3,32.9 76.9,32.3 76.9,28.7 77.4,28.2 78.15,28.2 R24.1 | R24.1 80.2,28.15 C18.1 | R24.1 R22.2
PU.0  (via drill 0.4)
  Top 0.305: U$1.38 62.55,32.45 59.8,29.7 59.8,23.3 59.4,22.9 v59.4,21.6 | R29.2 64.2,17.65 64.2,21.2 v63.8,21.6
  Top 0.406: R29.2 70,13.85 C12.1 72.1,13.75 R30.1 R31.2
  Bottom 0.305: v63.8,21.6 v59.4,21.6
PU.1  (via drill 0.4)
  Top 0.305: R23.2 63,16.75 v63,20.8 62.8,20.9 | U$1.40 63.55,31.85 61,29.3 61,20.9 v60.8,20.8
  Top 0.406: C13.1 65.8,13.75 R23.2
  Bottom 0.305: v63,20.8 v60.8,20.8
PUR  (via drill 0.4)
  Top 0.305: U$1.39 63.05,32.15 60.4,29.5 60.4,22.5 v60.2,22.5 | R32.2 69.15,18.9 66.5,18.9 65.1,20.3 v65.1,21.6
  Top 0.406: R32.2 R31.1
  Bottom 0.305: v65.1,21.6 64.2,22.5 v60.2,22.5
PV+  (via drill 0.4)
  Top 0.254: 11,13.06 9.76,13.06 9.6,12.9
  Top 0.305: v16.7,21.4 16.7,23 29.8,36.1 29.8,42.4 30.7,43.3 R21.2
  Top 0.406: R22.1 v78.2,21.4 | v11,15.6 11,13.06 | R19.1 6.1,22.42 arc-90 Q3.3
  Top 1.93: 7.4,10.5 8.36,10.5
  Top 3.81: X3.4 2.7,5.8 7.4,10.5 9.6,12.7 9.6,12.9 9.6,21.9 7.9,23.6 Q3.3
  Bottom 0.254: v78.2,21.4 78.2,8.3 77.2,7.3 75.8,7.3 74.8,6.3 74.8,2.4 73.2,0.8 3.6,0.8 2.7,1.7 X3.4
  Bottom 0.305: v11,15.6 16.7,21.3 v16.7,21.4
RST  (via drill 0.4)
  Top 0.305: R34.1 33.95,50.65 33.2,49.9 v33.2,49.3 | v68.3,32.8 67.55,32.8 U$1.48 | v50.5,35.8 53.5,32.8 v54.7,32.8
  Top 0.61: R34.1 34.6,53.06 JP5.2
  Bottom 0.305: v33.2,49.3 47.6,49.3 48.4,48.5 48.4,35.9 49,35.3 50,35.3 v50.5,35.8 | v54.7,32.8 v68.3,32.8
RX
  Top 0.61: R6.1 42.3,53.06 JP5.5
SCK  (via drill 0.4)
  Top 0.305: U6.5 47.6,8.04 47.6,12.1 52.5,17 52.5,18.2 55.8,21.5 55.8,29.3 | 55.8,29.3 55.8,34.3 55.9,34.4 v55.8,34.5 | U$1.32 57.05,36.85 v56.9,36.7 | LED2.A 54.35,29.3 55.8,29.3
  Bottom 0.305: v56.9,36.7 56.9,35.6 v55.8,34.5
SCL
  Top 0.305: 80.7,52.8 JP1.1 81,52.5 | U$1.3 70.75,35.85 72.9,33.7 | 80.9,47.7 81,47.6
  Top 0.406: 72.9,33.7 79.6,33.7 81,35.1 81,47.6 81,52.5 | R4.2 80.9,47.7
SDA  (via drill 0.4)
  Top 0.305: U$1.4 71.25,36.35 73.1,34.5
  Top 0.406: 79.7,45.5 v79.7,46.5 | v79.7,48.8 79.4,49.1 79.4,51.56 JP1.2 | 73.1,34.5 79.3,34.5 80.3,35.5 80.3,44.9 79.7,45.5 | R5.2 79.7,45.5
  Bottom 0.406: v79.7,48.8 v79.7,46.5
SENSE  (via drill 0.4)
  Top 0.305: R36.2 31.4,38.9 v31.1,39.2 | D2.A 15.3,36.54 v15.3,41.2
  Top 3.81: Q3.4 9.66,30.9 D2.A
  Bottom 0.305: v31.1,39.2 30.8,39.2 29.7,40.3 28.6,40.3 27.1,41.8 15.7,41.8 15.3,41.4 v15.3,41.2
TEST  (via drill 0.4)
  Top 0.305: R35.1 37.65,50.2 v38.6,50.2 | U$1.47 67.05,32.35 67.5,31.9 v67.8,31.9 | v49.3,36.3 49.3,35.8 53.3,31.8 v54.9,31.8
  Top 0.61: JP5.3 37.18,50.73 R35.1
  Bottom 0.305: v38.6,50.2 38.8,50 48,50 49.1,48.9 49.1,36.4 v49.3,36.3 | v67.8,31.9 67.6,32.1 55.5,32.1 55.2,31.8 v54.9,31.8
TX
  Top 0.61: R7.1 JP5.6
VBAT  (via drill 0.4)
  Top 0.254: R25.1 75.4,23 v76.4,22 | 10.5,7.1 8.6,4.3
  Top 0.305: 27.2,37.3 28,38.1 v29,38.1 | R28.2 31.4,34.5 v31.2,34.7
  Top 0.61: U$2.P$1 23.5,15.5 23.8,15.8 23.8,17.2 21.9,19.1 14,19.1 | 8.6,4.3 15.5,11 15.6,11.1 15.6,15.8 15.4,15.6 14,15.6
  Top 2.184: IC1.3 3.6,44.34 | 3.6,44.34 4.34,44.34 | 3.6,44.34 3.6,45.1
  Top 2.8: 14,11.79 X3.3
  Top 3.81: 14,11.79 14,15.6 14,19.1 14,24.1 27.2,37.3 27.2,46 24.7,48.5 C27.+ 8.5,48.5 5.1,45.1 3.6,45.1
  Bottom 0.254: v76.4,22 76.4,21.9 77.7,20.6 77.7,8.5 77,7.8 75.6,7.8 74.3,6.5 74.3,2.6 73,1.3 8.5,1.3 7.78,2.02 X3.3
  Bottom 0.305: v29,38.1 30.6,36.5 30.6,35.3 v31.2,34.7
VBAT_GND  (via drill 0.4)
  Top 0.406: 17.9,13.2 17.9,13.45 R40.1 | T1.2 6,14.45 v6,13.1 | IC2.2 17.5,40.39 v17.8,39.1 | LED8.C 31.7,41.1 v31.4,41.4 | LED6.C 31.7,45.5 v31.4,45.8 | LED7.C 31.9,36.7 v29.6,34.4 28.75,33.55 RL.2
  Top 0.61: C27.- 11.2,53.7 v15.7,53.7 | v9.6,35.1 11.6,37.1 C26.-
  Top 2.184: X3.2 X3.1 17.94,13.16 17.9,13.2
  Bottom 0.305: 29.6,45.8 29.5,45.7 29.2,45.7 | v29.6,34.4 29.5,34.4 29.2,34.1
  Bottom 0.406: v6,13.1 5.9,13 5.7,13 | v17.8,39.1 17.2,39.3 | v31.4,41.4 29.4,41.4 | v31.4,45.8 29.6,45.8
  Bottom 5: 17.9,15 22.7,19.9
  other vias: 12.4,35.1 7.5,53.7 21.7,21.4 28.7,21.4 12.4,28.2 17.9,15.6 15.7,52.3 7.5,52.3 9.6,36.4 12.4,36.4
  pour Bottom (isolate 0.406, no thermals): 0.6,0.7 19.3,0.7 19.3,18.1 29.8,18.1 29.8,55.4 0.6,55.4
  pour Top (isolate 0.305, no thermals): 0.7,0.8 19.3,0.8 19.3,18.2 29.9,18.2 29.9,55.3 0.7,55.3
VBUS  (via drill 0.4)
  Top 0.305: U$1.41 64.05,31.55 61.6,29.1 61.6,18 v61.4,17.8 | 61.7,10.3 61.6,10.2 v61.2,10.2
  Top 0.406: U$6.VBUS 63.7,9.1 63,9.8 62.2,9.8 61.7,10.3 C16.1
  Bottom 0.305: v61.2,10.2 61.4,10.4 v61.4,17.8
VCC  (via drill 0.4, 0.5)
  Top 0.305: U$5.1 35,9.5 35,9.8 35.9,10.7 35.9,11.3 38.5,13.9 C15.1 | U$1.7 67.8,37.85 67.8,38.85 | 67.8,38.85 67.8,39.8 67.85,39.85 U$1.11 70.25,39.85 73.15,42.75 C8.2 C17.2 | 67.8,38.85 U$1.28 59.35,38.85 58.6,39.6 C9.2 | 41.2,46.4 60.6,46.4 v60.8,46.6 | 41.2,46.4 arc-90 v40.8,46.8 | R34.2 34.6,47.6 35.3,46.9 35.9,46.9 36.4,46.4 41.2,46.4 | 58.95,40.35 60.2,41.6 v60.8,41.6
  Top 0.406: C15.1 38.45,14.05 | v40.8,46.8 41,46.6 | C9.2 58.95,40.35
  Top 0.61: R3.2 48.21,41.06 Q1.2 46.38,41.92 46,42.3 v40.8,42.3 40.7,42.2 40.7,40.7 41.9,39.5 41.9,37.7 40.8,36.6 39.8,36.6 39.3,36.1 39.3,17.7 38.5,16.9 38.5,16.15 C5.1 38.45,14.05 | JP5.4 39.72,47.88 v40.8,46.8
  Bottom 0.305: v60.8,41.6 v60.8,46.6
  Bottom 0.61: v40.8,42.3 v40.8,46.8
VCC_EN  (via drill 0.4)
  Top 0.305: C20.1 46.8,31.6 45.7,30.5 43.3,30.5 42.5,29.7 42.5,28.85 R9.2 42.7,28.55 U$3.1 U$3.2 U$3.3 41.8,25.1 41.8,19.1 43.4,17.5 43.4,6.6 | 48.7,7.84 U6.4 48.9,7.64 48.9,6.6 48,5.7 46.1,5.7 45.2,6.6 43.4,6.6 | 75.3,54.4 74.9,54.8 55.9,54.8 55,53.9 JP9.6 | R11.1 42.75,6.6 43.4,6.6
  Top 0.406: R5.1 R4.1 76.05,52.37 JP1.3 75.3,53.12 75.3,54.4 | U$4.2 47.05,37.3 v50.1,37.3 | v50.3,49.6 54.1,49.6 55,50.5 JP9.6
  Top 0.61: U$4.2 46.45,34.7 C38.2 46.8,34.15 C20.1
  Bottom 0.406: v50.3,49.6 50.3,49.1 49.8,48.6 49.8,37.3 v50.1,37.3
VCELL
  Top 0.305: U$5.10 39.7,10.43 G1.+
VIN
  Top 0.61: 23.93,11.15 U1.1 25.5,11.15 | 25.5,11.15 25.5,9.25 U1.3 | 27,12.5 C3.1 | C3.1 28.65,12.8 C6.1 | 25.5,11.15 25.5,12.5 U$2.P$2 27,12.4 C3.1
VUSB
  Top 0.305: U$1.42 64.55,31.25 62.2,28.9 62.2,17.4 61.7,16.9 U$8.1
  Top 0.406: C14.1 59.55,11.8 58.4,11.8 57.8,12.4 57.8,13.2 57.1,13.8 57.1,14.8 58.74,16.44 U$8.1

### Text on the board
tmine: gnd | rst | test | vcc | rx | tx | gnd | debug | en | digital | i2c | gnd | vcc | 4.0 | 1.3 | 1.2 | 1.1 | 1.0 | gnd | vcc | en | sda | scl | pv | chg | bat | s0 | s1 | s2 | th | gnd | gnd | 15-36v / pv cell | 12v / bat | sc rev 03 Petre Rodan 201308